# Altium project mSAS-IDC-adapter.PrjPCB
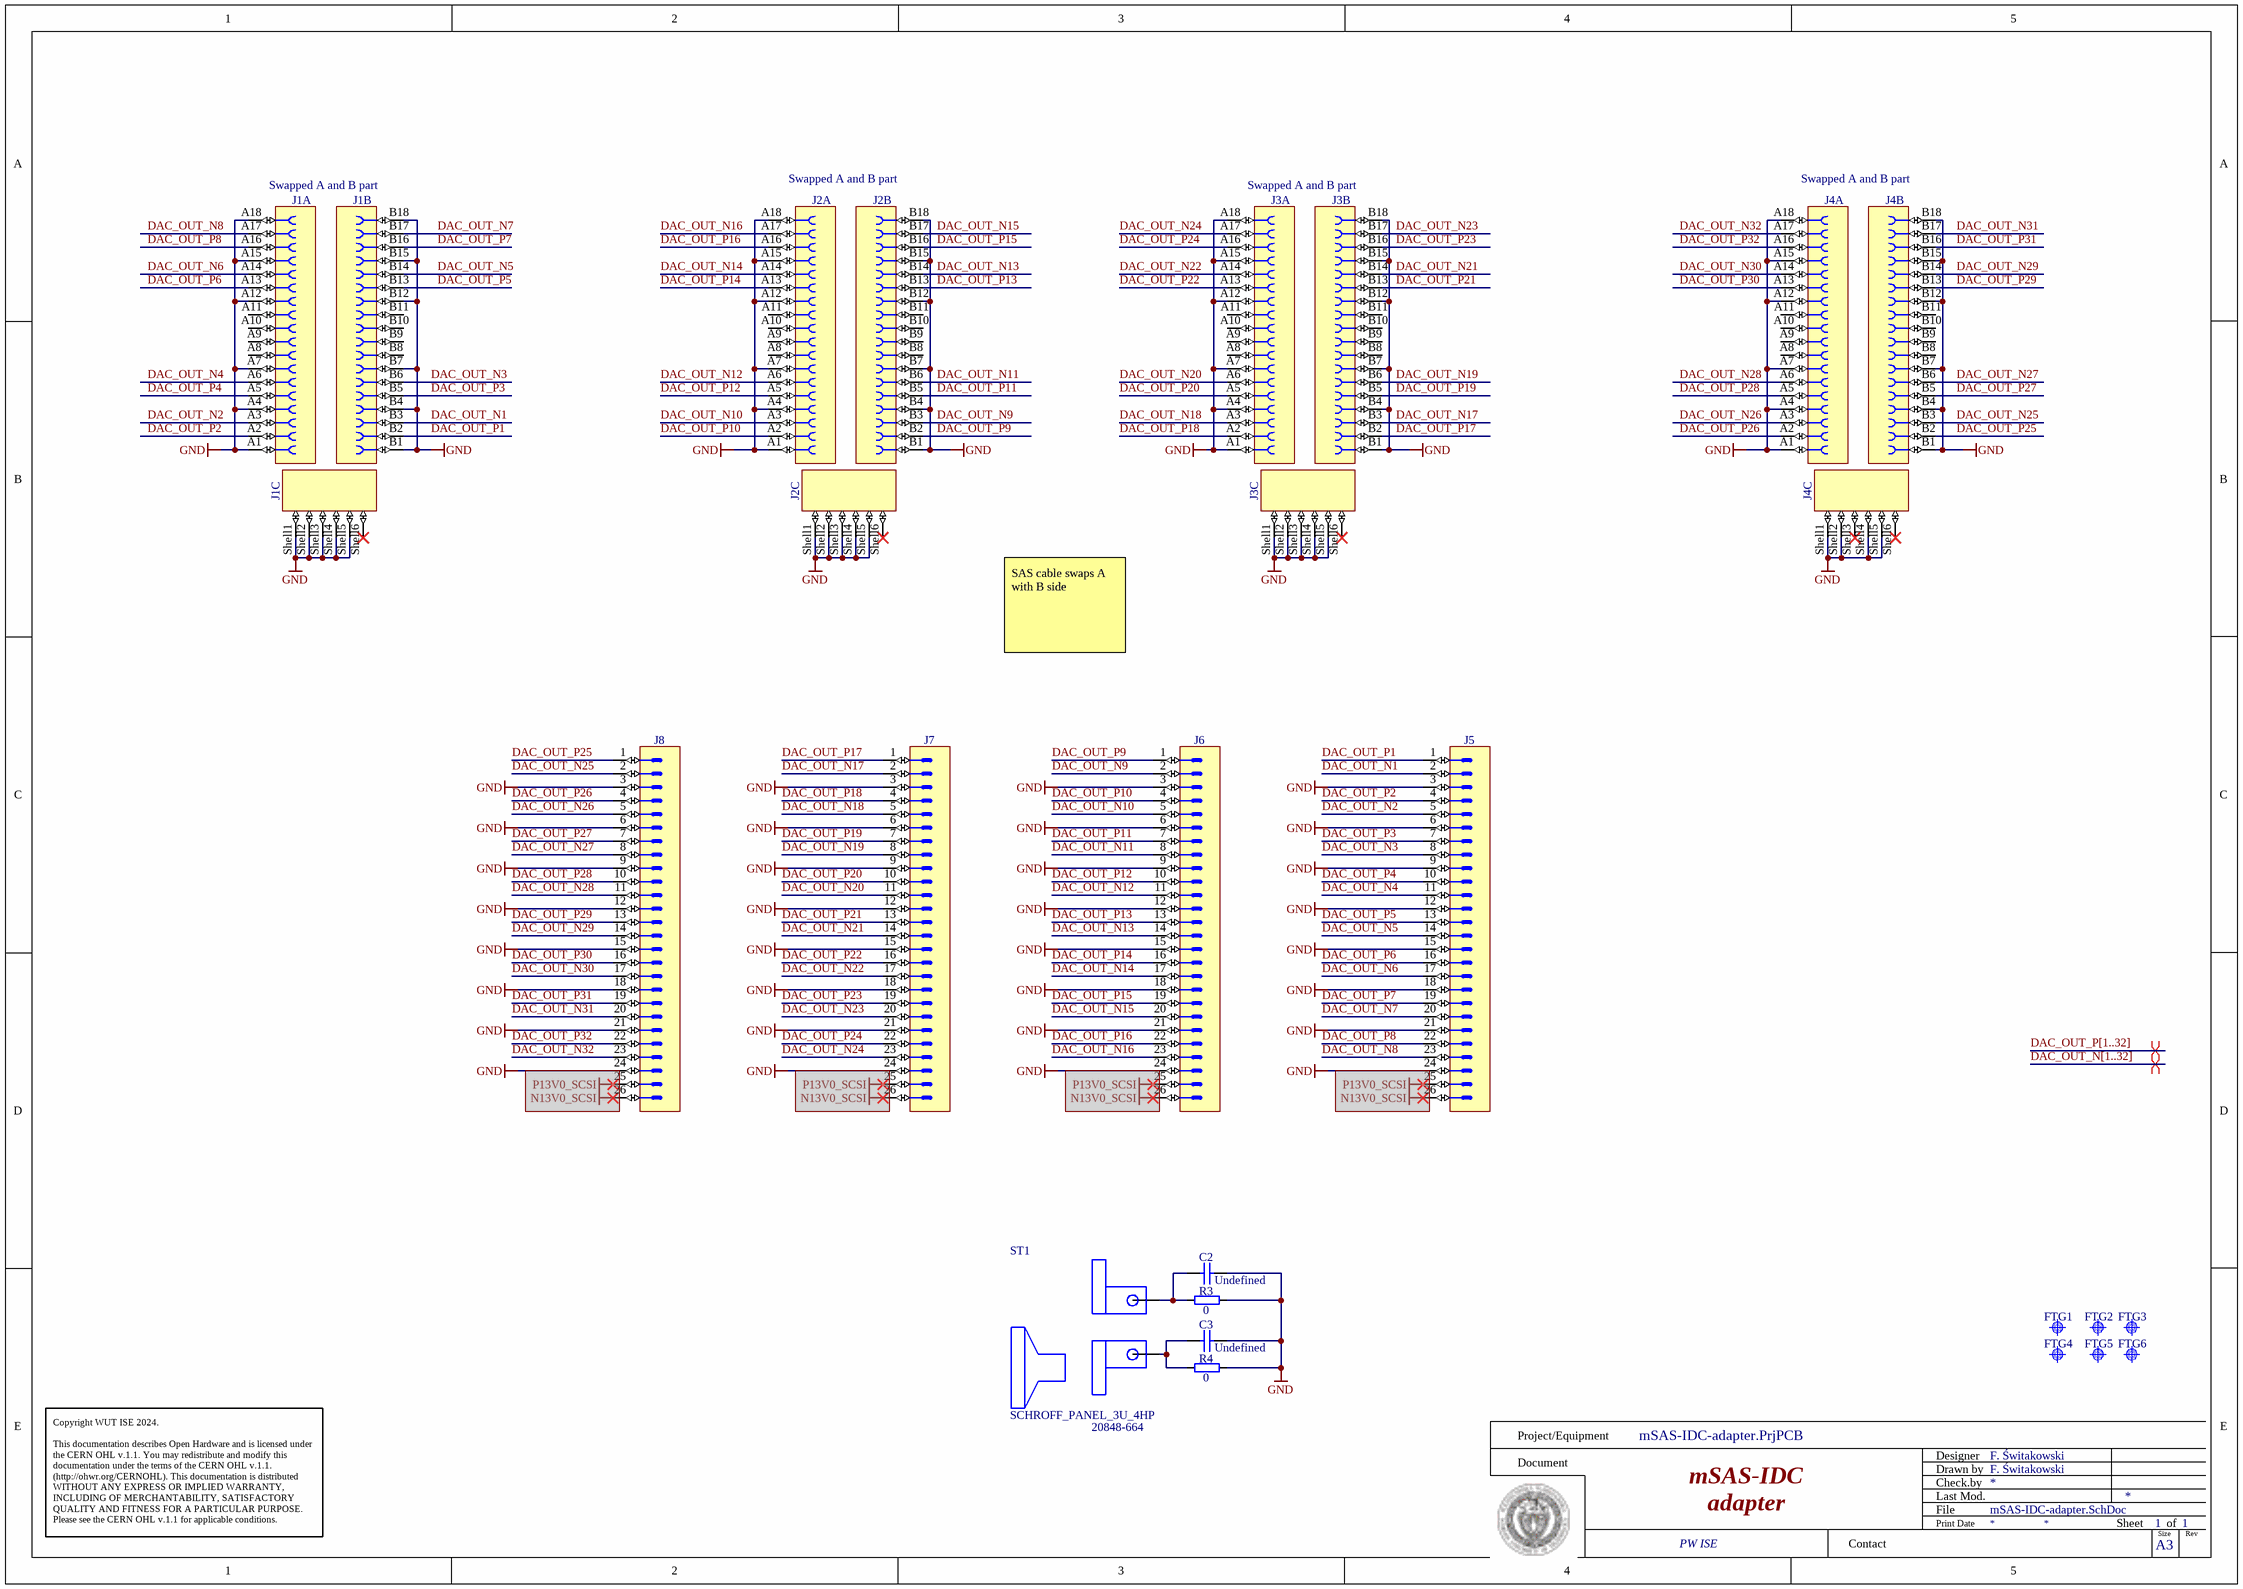
[diagram p0: mSAS-IDC-adapter.SchDoc]
rev: 1.0; designer: F. Świtakowski
1 sheet, 19 parts. Net scope: hierarchical (ports join the sheet entries above them; power ports are global).
Board file: mSAS-IDC-adapter.PCBDOC

## Sheet mSAS-IDC-adapter.SchDoc: mSAS-IDC
size 420 x 297 mm; Author: F. Świtakowski; DrawnBy: F. Świtakowski; Organization: PW ISE; Address1: PW ISE; Address2: Nowowiejska 15/19 00-665 Warsaw; Revision: 1.0; SheetNumber: 1; SheetTotal: 1; Title2: adapter

### Parts
C2  Undefined  [CAPC2012X135N]
C3  Undefined  [CAPC2012X135N]
FTG1  Use only in PCB  [FIDUCIAL_TOP_C100-200]  (value not drawn)  (no BOM)
FTG2  Use only in PCB  [FIDUCIAL_TOP_S100-200]  (value not drawn)  (no BOM)
FTG3  Use only in PCB  [FIDUCIAL_TOP_S100-200]  (value not drawn)  (no BOM)
FTG4  Use only in PCB  [FIDUCIAL_TOP_S100-200]  (value not drawn)  (no BOM)
FTG5  Use only in PCB  [FIDUCIAL_TOP_S100-200]  (value not drawn)  (no BOM)
FTG6  Use only in PCB  [FIDUCIAL_TOP_S100-200]  (value not drawn)  (no BOM)
J1  iPass™  [MOLEX_75783-0107]  (value not drawn)  (parts A,B,C of 3)
J2  iPass™  [MOLEX_75783-0107]  (value not drawn)  (parts A,B,C of 3)
J3  iPass™  [MOLEX_75783-0107]  (value not drawn)  (parts A,B,C of 3)
J4  iPass™  [MOLEX_75783-0107]  (value not drawn)  (parts A,B,C of 3)
J5  Header 26  [3M_N2526-6002RB]  (value not drawn)
J6  Header 26  [3M_N2526-6002RB]  (value not drawn)
J7  Header 26  [3M_N2526-6002RB]  (value not drawn)
J8  Header 26  [3M_N2526-6002RB]  (value not drawn)
R3  0  [RESC1005X40N]
R4  0  [RESC1005X40N]
ST1  SCHROFF_PANEL_3U_4HP  Manufacturer Part Number: 20848-664  [SCHROFF_PANEL_3HP_4U]

### Nets
GND: C2.2 C3.2 J1.A1 J1.A4 J1.A7 J1.A12 J1.A15 J1.A18 J1.B1 J1.B4 J1.B7 J1.B12 J1.B15 J1.B18 J1.Shell1 J1.Shell2 J1.Shell3 J1.Shell4 J1.Shell5 J2.A1 J2.A4 J2.A7 J2.A12 J2.A15 J2.A18 J2.B1 J2.B4 J2.B7 J2.B12 J2.B15 J2.B18 J2.Shell1 J2.Shell2 J2.Shell3 J2.Shell4 J2.Shell5 J3.A1 J3.A4 J3.A7 J3.A12 J3.A15 J3.A18 J3.B1 J3.B4 J3.B7 J3.B12 J3.B15 J3.B18 J3.Shell1 J3.Shell2 J3.Shell3 J3.Shell4 J3.Shell5 J4.A1 J4.A4 J4.A7 J4.A12 J4.A15 J4.A18 J4.B1 J4.B4 J4.B7 J4.B12 J4.B15 J4.B18 J4.Shell1 J4.Shell2 J4.Shell4 J4.Shell5 J5.3 J5.6 J5.9 J5.12 J5.15 J5.18 J5.21 J5.24 J6.3 J6.6 J6.9 J6.12 J6.15 J6.18 J6.21 J6.24 J7.3 J7.6 J7.9 J7.12 J7.15 J7.18 J7.21 J7.24 J8.3 J8.6 J8.9 J8.12 J8.15 J8.18 J8.21 J8.24 R3.2 R4.2
DAC_OUT_N1: J1.B3 J5.2
DAC_OUT_N2: J1.A3 J5.5
DAC_OUT_N3: J1.B6 J5.8
DAC_OUT_N4: J1.A6 J5.11
DAC_OUT_N5: J1.B14 J5.14
DAC_OUT_N6: J1.A14 J5.17
DAC_OUT_N7: J1.B17 J5.20
DAC_OUT_N8: J1.A17 J5.23
DAC_OUT_N9: J2.B3 J6.2
DAC_OUT_N10: J2.A3 J6.5
DAC_OUT_N11: J2.B6 J6.8
DAC_OUT_N12: J2.A6 J6.11
DAC_OUT_N13: J2.B14 J6.14
DAC_OUT_N14: J2.A14 J6.17
DAC_OUT_N15: J2.B17 J6.20
DAC_OUT_N16: J2.A17 J6.23
DAC_OUT_N17: J3.B3 J7.2
DAC_OUT_N18: J3.A3 J7.5
DAC_OUT_N19: J3.B6 J7.8
DAC_OUT_N20: J3.A6 J7.11
DAC_OUT_N21: J3.B14 J7.14
DAC_OUT_N22: J3.A14 J7.17
DAC_OUT_N23: J3.B17 J7.20
DAC_OUT_N24: J3.A17 J7.23
DAC_OUT_N25: J4.B3 J8.2
DAC_OUT_N26: J4.A3 J8.5
DAC_OUT_N27: J4.B6 J8.8
DAC_OUT_N28: J4.A6 J8.11
DAC_OUT_N29: J4.B14 J8.14
DAC_OUT_N30: J4.A14 J8.17
DAC_OUT_N31: J4.B17 J8.20
DAC_OUT_N32: J4.A17 J8.23
DAC_OUT_P1: J1.B2 J5.1
DAC_OUT_P2: J1.A2 J5.4
DAC_OUT_P3: J1.B5 J5.7
DAC_OUT_P4: J1.A5 J5.10
DAC_OUT_P5: J1.B13 J5.13
DAC_OUT_P6: J1.A13 J5.16
DAC_OUT_P7: J1.B16 J5.19
DAC_OUT_P8: J1.A16 J5.22
DAC_OUT_P9: J2.B2 J6.1
DAC_OUT_P10: J2.A2 J6.4
DAC_OUT_P11: J2.B5 J6.7
DAC_OUT_P12: J2.A5 J6.10
DAC_OUT_P13: J2.B13 J6.13
DAC_OUT_P14: J2.A13 J6.16
DAC_OUT_P15: J2.B16 J6.19
DAC_OUT_P16: J2.A16 J6.22
DAC_OUT_P17: J3.B2 J7.1
DAC_OUT_P18: J3.A2 J7.4
DAC_OUT_P19: J3.B5 J7.7
DAC_OUT_P20: J3.A5 J7.10
DAC_OUT_P21: J3.B13 J7.13
DAC_OUT_P22: J3.A13 J7.16
DAC_OUT_P23: J3.B16 J7.19
DAC_OUT_P24: J3.A16 J7.22
DAC_OUT_P25: J4.B2 J8.1
DAC_OUT_P26: J4.A2 J8.4
DAC_OUT_P27: J4.B5 J8.7
DAC_OUT_P28: J4.A5 J8.10
DAC_OUT_P29: J4.B13 J8.13
DAC_OUT_P30: J4.A13 J8.16
DAC_OUT_P31: J4.B16 J8.19
DAC_OUT_P32: J4.A16 J8.22
NetC2_1: C2.1 R3.1 ST1.1
NetC3_1: C3.1 R4.1 ST1.0

Not connected (* = marked no-connect by the designer): J1 A8 A9 A10 A11 B8 B9 B10 B11 Shell6*; J2 A8 A9 A10 A11 B8 B9 B10 B11 Shell6*; J3 A8 A9 A10 A11 B8 B9 B10 B11 Shell6*; J4 A8 A9 A10 A11 B8 B9 B10 B11 Shell3* Shell6*; J5 25* 26*; J6 25* 26*; J7 25* 26*; J8 25* 26*

### Buses and harness runs
bus DAC_OUT_N[1..32]
bus DAC_OUT_P[1..32]

### Layout directives
differential pair: (no net found under the mark)

### Notes on the sheet
- (near J1) Swapped A and B part
- (near J2) Swapped A and B part
- (near J3) Swapped A and B part
- (near J4) Swapped A and B part
- SAS cable swaps A with B side
- Project/Equipment
- Document
- Designer
- Drawn by
- Check.by
- Copyright WUT ISE 2024.
  This documentation describes Open Hardware and is licensed under the CERN OHL v.1.1. You may redistribute and modify this documentation under the terms of the CERN OHL v.1.1. (http://ohwr.org/CERNOHL). This documentation is distributed WITHOUT ANY EXPRESS OR IMPLIED WARRANTY, INCLUDING OF MERCHANTABILITY, SATISFACTORY QUALITY AND FITNESS FOR A PARTICULAR PURPOSE. Please see the CERN OHL v.1.1 for applicable conditions.
- Contact
- File
- Last Mod.
- Print Date
- Sheet
- Size
- A3
- of
- Rev

### Library data of the parts
C2 C3 = CC0805_NO-VALUE: Non-polarised capacitor; Part Description: Reserved Footprint For 0805(2012) Chip Ceramic Capacitor; Mounted: No; Part Number: CC0805_NO-VALUE; Component Kind: Standard; Component Type: Standard; Pin Count: 2; Value: Undefined; Status: None; Manufacturer: Undefined; Manufacturer Part Number: CC0805_NO-VALUE; Case: 0805; Socket: No; SMD: Yes; Sense: No; Manufacturer1 ComponentHeight: 1.35mm; HelpURL: Undefined; Author: CERN DEM JLC; CreateDate: 10.12.2008; LatestRevisionDate: 11.09.2013
FTG1 = FIDUCIAL_TARGET_C100-200: Fiducial Target; Part Description: Round Fiducial Target, Top Layer, 1.0mm, Top Solder 2.0mm, Keepout =2.0mm; Mounted: No; Part Number: FIDUCIAL_TARGET_C100-200; Component Type: Standard (No BOM); Pin Count: 1; Family: Fiducial; Socket: No; SMD: Yes; Sense: No; Status: None; ComponentHeight: 0mm; HelpURL: Undefined; Author: CERN DEM JLC; CreateDate: 09.02.2010; LatestRevisionDate: 04.04.2012; PackageDescription: Round Fiducial Target, Top Layer, 1.0mm, Top Solder 2.0mm, Keepout =2.0mm
FTG2-FTG6 = FIDUCIAL_TARGET_S100-200: Fiducial Target; Part Description: Square Fiducial Target, Top Layer, 1.0mm, Top Solder 2.0mm, Keepout =2.0mm; Mounted: No; Part Number: FIDUCIAL_TARGET_S100-200; Component Type: Standard (No BOM); Pin Count: 1; Family: Fiducial; Socket: No; SMD: Yes; Sense: No; Status: None; ComponentHeight: 0mm; HelpURL: Undefined; Author: CERN DEM JLC; CreateDate: 09.02.2010; LatestRevisionDate: 04.04.2012; PackageDescription: Square Fiducial Target, Top Layer, 1.0mm, Top Solder 2.0mm, Keepout =2.0mm
J1-J4 = MOLEX_75783-0107: 36 Circuit, Right Angle , Internal Assembly, iPass™ I/O Surface Mount Receptacle with Left Key Shell; Part Number: MOLEX 75783-0107 / 75783-0136; Manufacturer: MOLEX; Manufacturer Part Number: 75783-0107 / 75783-0136; PressFit: No; Component Kind: Standard; Component Type: Standard; Pin Count: 42; Family: iPass™; Mounted: Yes; Socket: No; SMD: Yes; Sense: No; Status: None; Part Description: 36 Circuit, Right Angle , Internal Assembly, iPass™ I/O Surface Mount Receptacle with Left Key Shell; ComponentHeight: 8.47mm; HelpURL: \\cern.ch\dfs\Applications\Altium\Datasheets\MOLEX_75783-0107.pdf; Author: CERN DEM JLC; CreateDate: 12.11.2014; LatestRevisionDate: 12.11.2014
J5-J8 = 3M_N2526-6002RB: Connector 26 Male; Part Description: 26 Contacts - Straight .100'' x .100'' Low Profile Four-Wall Header, 2500 Series; Manufacturer: 3M; PressFit: No; Part Number: 3M_N2526-6002RB; Component Kind: Standard; Component Type: Standard; Pin Count: 26; Family: Header 26; Mounted: Yes; Socket: No; SMD: No; Sense: No; Status: None; Manufacturer Part Number: N2526-6002RB; ComponentHeight: 10.03mm; HelpURL: \\cern.ch\dfs\Applications\Altium\Datasheets\3M_N2526-6002RB.pdf; Author: CERN DEM JLC; CreateDate: 11.02.2009; LatestRevisionDate: 11.08.2009
R3 R4 = R0402_0R_JUMPER: Resistor; Part Description: 1A (0.05R Max DC Resistance) Zero Ohm Jumper; Manufacturer: GENERIC; Manufacturer1 Part Number: 232270591001L; PressFit: No; Part Number: R0402_0R_JUMPER; Component Kind: Standard; Component Type: Standard; Pin Count: 2; Value: 0; Status: Not Recommended; Manufacturer Part Number: R0402_0R_JUMPER; Case: 0402; Mounted: Yes; Sense: No; Socket: No; SMD: Yes; Manufacturer1 Example: YAGEO PHYCOMP; Manufacturer1 ComponentHeight: 0.4mm; HelpURL: \\cern.ch\dfs\Applications\Altium\Datasheets\R0402_Phycomp_RC0402.pdf; Author: CERN DEM JLC; CreateDate: 03.12.2007; LatestRevisionDate: 17.10.2012
ST1 = SCHROFF_PANEL_3U_4HP: Schroff 3HP 4U EUROCARD Panel Kit; Manufacturer: Schroff; Manufacturer Part Number 2: 20848-664

## Assembly variants
Default: not fitted C2 C3